# EAGLE schematic tinyups (EAGLE 6.4)
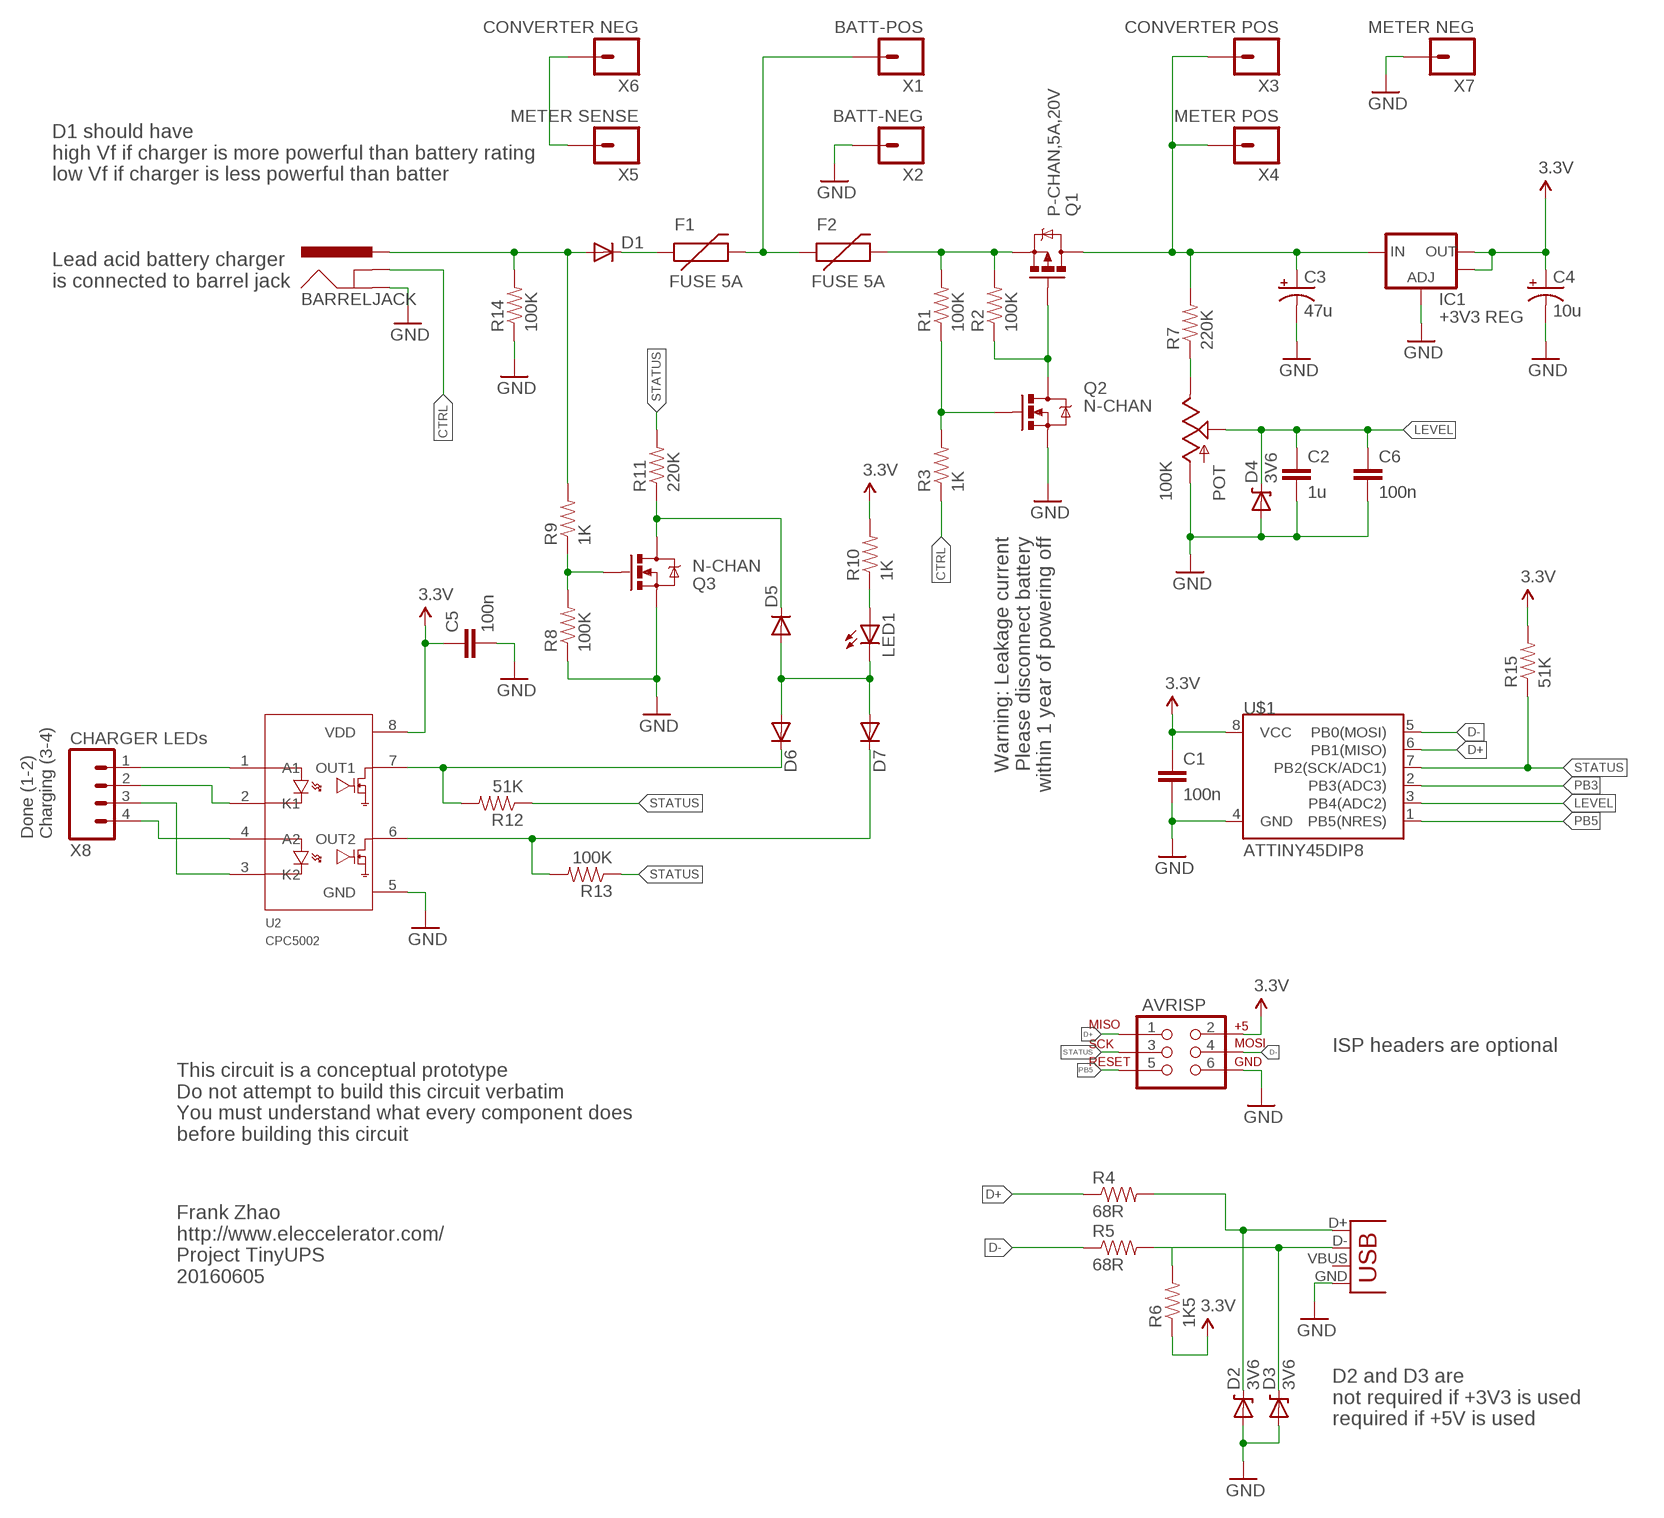
[diagram p0: schematic, sheet 1]

## Parts
AVRISP  AVR_SPI_PRG_6NS  [2X3-NS]
BARRELJACK  POWER_JACK-LO-PROFILE  [DC-BARREL-JACK-LO-PROFILE]
C1  100n  CAP0603-CAP  [0603-CAP]
C2  1u  CAP0603-CAP  [0603-CAP]
C3  47u  CAP_POL1206  [EIA3216]
C4  10u  CAP_POL1206  [EIA3216]
C5  100n  CAP0603-CAP  [0603-CAP]
C6  100n  CAP0603-CAP  [0603-CAP]
D1  DIODE1N4148  [DIODE-1N4148]
D2  3V6  DIODE-ZENER-BZT52  [SOD-323]
D3  3V6  DIODE-ZENER-BZT52  [SOD-323]
D4  3V6  DIODE-ZENER-BZT52  [SOD-323]
D5  DIODESOD  [SOD-323]
D6  DIODESOD  [SOD-323]
D7  DIODESOD  [SOD-323]
F1  FUSE 5A  PTCPTH  [PTC]
F2  FUSE 5A  PTCPTH  [PTC]
IC1  +3V3 REG  V_REG_LM1117SOT223  [SOT223]
LED1  LED3MM  [LED3MM]
POT  100K  POT-MODEL89  [POT-MODEL89]
Q1  P-CHAN,5A,20V  MOSFET-PCHANNEL-TO220V  [TO220V]
Q2  N-CHAN  MOSFET-NCHANNELSMD  [SOT23-3]
Q3  N-CHAN  MOSFET-NCHANNELSMD  [SOT23-3]
R1  100K  RESISTOR0603-RES  [0603-RES]
R2  100K  RESISTOR0603-RES  [0603-RES]
R3  1K  RESISTOR0603-RES  [0603-RES]
R4  68R  RESISTOR0603-RES  [0603-RES]
R5  68R  RESISTOR0603-RES  [0603-RES]
R6  1K5  RESISTOR0603-RES  [0603-RES]
R7  220K  RESISTOR0603-RES  [0603-RES]
R8  100K  RESISTOR0603-RES  [0603-RES]
R9  1K  RESISTOR0603-RES  [0603-RES]
R10  1K  RESISTOR0603-RES  [0603-RES]
R11  220K  RESISTOR0603-RES  [0603-RES]
R12  51K  RESISTOR0603-RES  [0603-RES]
R13  100K  RESISTOR0603-RES  [0603-RES]
R14  100K  RESISTOR0603-RES  [0603-RES]
R15  51K  RESISTOR0603-RES  [0603-RES]
U2  CPC5002  OPTOISOLATOR-CPC5002  [OPTOISOLATOR-DIPSMD-8]
U$1  ATTINY45DIP8  [DIP08]
USB  USB-MB-H  [USB-MB-H]
X1  BATT-POS  M01PTH  [1X01]
X2  BATT-NEG  M01PTH  [1X01]
X3  CONVERTER POS  M01PTH  [1X01]
X4  METER POS  M01PTH  [1X01]
X5  METER SENSE  M01PTH  [1X01]
X6  CONVERTER NEG  M01PTH  [1X01]
X7  METER NEG  M01PTH  [1X01]
X8  CHARGER LEDs  M04PTH  [1X04]

## Nets
3.3V: AVRISP.2 C1.1 C4.A(+) C5.1 IC1.2(OUT) IC1.4(OUT) R6.1 R10.2 R15.2 U2.8(VDD) U$1.8(VCC)
CTRL: BARRELJACK.3(GNDBREAK) R3.1
D+: AVRISP.1 R4.1 U$1.6(PB1(MISO))
D-: AVRISP.4 R5.1 U$1.5(PB0(MOSI))
DASDASD: D6.1(C) R12.2 U2.7(OUT1)
DFGDFGDF: D7.1(C) R13.2 U2.6(OUT2)
GND: AVRISP.6 BARRELJACK.2(GND) C1.2 C2.2 C3.C(-) C4.C(-) C5.2 C6.2 D2.2(A) D3.2(A) D4.2(A) IC1.1(ADJ) POT.3(A) Q2.2(S) Q3.2(S) R8.1 R14.1 U2.5(GND) U$1.4(GND) USB.GND X2.1 X7.1
LEVEL: C2.1 C6.1 D4.1(C) POT.W(S) U$1.3(PB4(ADC2))
N$1: BARRELJACK.1(PWR) D1.A R9.2 R14.2
N$2: X5.1 X6.1
N$3: POT.1(E) R7.1
N$4: Q1.1(G) Q2.3(D) R2.1
N$5: C3.A(+) IC1.3(IN) Q1.2(D) R7.2 X3.1 X4.1
N$6: Q2.1(G) R1.1 R3.2
N$7: D5.1(C) Q3.3(D) R11.1
N$8: U2.1(A1) X8.1
N$9: D3.1(C) R5.2 R6.2 USB.D-
N$10: D2.1(C) R4.2 USB.D+
N$11: F2.P$2 Q1.3(S) R1.2 R2.2
N$12: F1.P$2 F2.P$1 X1.1
N$13: Q3.1(G) R8.2 R9.1
N$15: D1.C F1.P$1
N$17: LED1.A R10.1
N$19: U2.2(K1) X8.2
N$20: U2.4(A2) X8.4
N$21: U2.3(K2) X8.3
N$22: D5.2(A) D6.2(A) D7.2(A) LED1.K(C)
PB3: U$1.2(PB3(ADC3))
PB5: AVRISP.5 U$1.1(PB5(NRES))
STATUS: AVRISP.3 R11.2 R12.1 R13.1 R15.1 U$1.7(PB2(SCK/ADC1))
Unconnected: USB.VBUS

## Notes on the sheet
- D1 should have
  high Vf if charger is more powerful than battery rating
  low Vf if charger is less powerful than batter
- Lead acid battery charger
  is connected to barrel jack
- Warning: Leakage current
  Please disconnect battery
  within 1 year of powering off
- Done (1-2)
  Charging (3-4)
- ISP headers are optional
- This circuit is a conceptual prototype
  Do not attempt to build this circuit verbatim
  You must understand what every component does
  before building this circuit
- Frank Zhao
  http://www.eleccelerator.com/
  Project TinyUPS
  20160605
- D2 and D3 are
  not required if +3V3 is used
  required if +5V is used

## Library data of the parts
AVRISP = tinyups:AVR_SPI_PRG_6: AVR ISP 6 Pin This is the reduced ISP connector for AVR programming. Common on Arduino. This footprint will take up less PCB space and can be used with a 10-pin to 6-pin adapter such as SKU: BOB-08508
BARRELJACK = tinyups:POWER_JACK: Power Jack This is the standard 5.5mm barrel jack for power. The PTH is the most common, proven, reliable, footprint. All others are experimental. The Slot footprint only works if the mill layer is transmitted to the PCB fab house so be warned. Spark Fun Electronics SKU : PRT-00119. Mating wall wart : TOL-00298 (and others)
C1 C2 C5 C6 = tinyups:CAP: Capacitor Standard 0603 ceramic capacitor, and 0.1" leaded capacitor.
C3 C4 = tinyups:CAP_POL: Capacitor Polarized These are standard SMD and PTH capacitors. Normally 10uF, 47uF, and 100uF in electrolytic and tantalum varieties. Always verify the external diameter of the through hole cap, it varies with capacity, voltage, and manufacturer. The EIA devices should be standard.
D1 D5-D7 = tinyups:DIODE: Diode These are standard reverse protection diodes and small signal diodes. SMA package can handle up to about 1A. SOD-323 can handle about 200mA. What the SOD-323 package when ordering, there are some mfgs out there that are 5-pin packages.
D2-D4 = tinyups:DIODE-ZENER: Zener Diode Production Part - 8199 3.4V Zener Voltage
F1 F2 = tinyups:PTC: Resettable Fuse PTC Resettable Fuse. Spark Fun Electronics SKU : COM-08357
IC1 = tinyups:V_REG_LM1117: Voltage Regulator LM1117 Standard adjustable voltage regulator but in SMD form. Spark Fun Electronics SKU : COM-00595
LED1 = tinyups:LED: LEDs Standard schematic elements and footprints for 5mm, 3mm, 1206, and 0603 sized LEDs. 5mm - Spark Fun Electronics SKU : COM-00529 (and others)
POT = tinyups:POT
Q1 = tinyups:MOSFET-PCHANNEL
Q2 Q3 = tinyups:MOSFET-NCHANNEL
R1-R15 = tinyups:RESISTOR: Resistor Basic schematic elements and footprints for 0603, 1206, and PTH resistors.
U2 = tinyups:OPTOISOLATOR-CPC5002
U$1 = tinyups:ATTINY45: Atmel ATTiny45
USB = tinyups:USB: USB Connectors USB-B-PTH is fully proven SKU : PRT-00139 USB-miniB is fully proven SKU : PRT-00587 USB-A-PCB is untested. USB-A-H is throughly reviewed, but untested. Spark Fun Electronics SKU : PRT-00437 USB-B-SMT is throughly reviewed, but untested. Needs silkscreen touching up. USB-A-S has not been used/tested USB-MB-H has not been used/tested
X1-X7 = tinyups:M01: Header 1 Standard 1-pin 0.1" header. Use with straight break away headers (SKU : PRT-00116), right angle break away headers (PRT-00553), swiss pins (PRT-00743), machine pins (PRT-00117), and female headers (PRT-00115).
X8 = tinyups:M04: Header 4 Standard 4-pin 0.1" header. Use with straight break away headers (SKU : PRT-00116), right angle break away headers (PRT-00553), swiss pins (PRT-00743), machine pins (PRT-00117), and female headers (PRT-00115). Molex polarized connector foot print use with SKU : PRT-08231 with associated crimp pins and housings. 1MM SMD Version SKU: PRT-10208